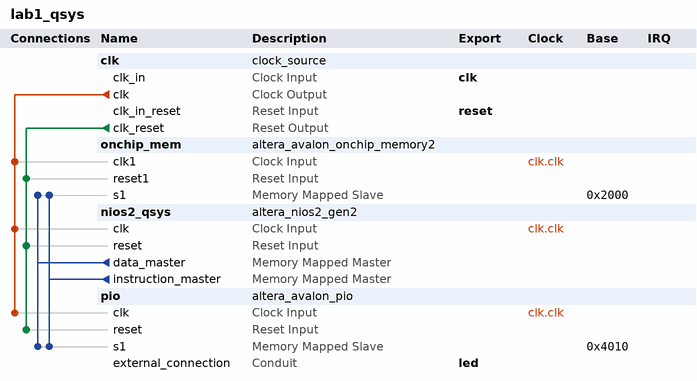
[diagram p0: system contents]
# Platform Designer (Qsys) system lab1_qsys, Cyclone IV E EP4CE6E22C8
# Parameters at their usual value, and those the tool derives, are not listed.
package require -exact qsys 17.1
create_system lab1_qsys
set_project_property DEVICE_FAMILY {Cyclone IV E}
set_project_property DEVICE EP4CE6E22C8

add_instance clk clock_source 17.1
set_instance_parameter_value clk clockFrequency 25000000

add_instance onchip_mem altera_avalon_onchip_memory2 17.1
set_instance_parameter_value onchip_mem dataWidth 32
set_instance_parameter_value onchip_mem dualPort false
set_instance_parameter_value onchip_mem initMemContent true
set_instance_parameter_value onchip_mem initializationFileName onchip_mem.hex
set_instance_parameter_value onchip_mem memorySize 8192
set_instance_parameter_value onchip_mem useNonDefaultInitFile true

add_instance nios2_qsys altera_nios2_gen2 17.1
set_instance_parameter_value nios2_qsys dcache_size 2048
set_instance_parameter_value nios2_qsys debug_enabled false
set_instance_parameter_value nios2_qsys exceptionSlave onchip_mem.s1
set_instance_parameter_value nios2_qsys icache_size 4096
set_instance_parameter_value nios2_qsys impl Tiny
set_instance_parameter_value nios2_qsys resetSlave onchip_mem.s1

add_instance pio altera_avalon_pio 17.1
set_instance_parameter_value pio direction Output
set_instance_parameter_value pio width 8

# connections
add_connection clk.clk nios2_qsys.clk clock
add_connection clk.clk onchip_mem.clk1 clock
add_connection clk.clk pio.clk clock
add_connection clk.clk_reset nios2_qsys.reset reset
add_connection clk.clk_reset onchip_mem.reset1 reset
add_connection clk.clk_reset pio.reset reset
add_connection nios2_qsys.data_master onchip_mem.s1 avalon
set_connection_parameter_value nios2_qsys.data_master/onchip_mem.s1 baseAddress 0x2000
add_connection nios2_qsys.data_master pio.s1 avalon
set_connection_parameter_value nios2_qsys.data_master/pio.s1 baseAddress 0x4010
add_connection nios2_qsys.instruction_master onchip_mem.s1 avalon
set_connection_parameter_value nios2_qsys.instruction_master/onchip_mem.s1 baseAddress 0x2000
add_connection nios2_qsys.instruction_master pio.s1 avalon
set_connection_parameter_value nios2_qsys.instruction_master/pio.s1 baseAddress 0x4010

# exported interfaces
add_interface clk clock sink
set_interface_property clk EXPORT_OF clk.clk_in
add_interface led conduit end
set_interface_property led EXPORT_OF pio.external_connection
add_interface reset reset sink
set_interface_property reset EXPORT_OF clk.clk_in_reset

set_interconnect_requirement {$system} qsys_mm.clockCrossingAdapter HANDSHAKE
set_interconnect_requirement {$system} qsys_mm.enableEccProtection FALSE
set_interconnect_requirement {$system} qsys_mm.insertDefaultSlave FALSE
set_interconnect_requirement {$system} qsys_mm.maxAdditionalLatency 1

save_system lab1_qsys.qsys
